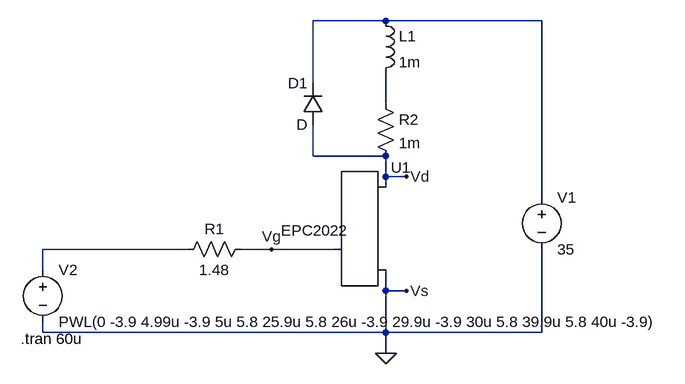
[diagram p0: schematic DPT_EPC2022.asc]
DPT_EPC2022.asc, the LTspice schematic file:
Version 4
SHEET 1 880 680
WIRE -48 -176 -160 -176
WIRE 192 -176 -48 -176
WIRE -160 -80 -160 -176
WIRE -48 -48 -48 -96
WIRE -160 32 -160 -16
WIRE -48 32 -160 32
WIRE -48 64 -48 32
WIRE -16 64 -48 64
WIRE -48 80 -48 64
WIRE 192 96 192 -176
WIRE -352 176 -576 176
WIRE -224 176 -272 176
WIRE -128 176 -224 176
WIRE -576 208 -576 176
WIRE -48 240 -48 208
WIRE -16 240 -48 240
WIRE -576 304 -576 288
WIRE -48 304 -48 240
WIRE -48 304 -576 304
WIRE 192 304 192 176
WIRE 192 304 -48 304
WIRE -48 336 -48 304
FLAG -16 240 Vs
FLAG -16 64 Vd
FLAG -224 176 Vg
FLAG -48 336 0
SYMBOL EPCGaN -128 176 R0
WINDOW 3 -81 -29 Left 2
SYMATTR Value EPC2022
SYMATTR InstName U1
SYMBOL res -64 -64 R0
SYMATTR InstName R2
SYMATTR Value 1m
SYMBOL ind -64 -192 R0
SYMATTR InstName L1
SYMATTR Value 1m
SYMBOL diode -144 -16 R180
WINDOW 0 24 64 Left 2
WINDOW 3 24 0 Left 2
SYMATTR InstName D1
SYMBOL voltage 192 80 R0
WINDOW 123 0 0 Left 0
WINDOW 39 0 0 Left 0
SYMATTR InstName V1
SYMATTR Value 35
SYMBOL voltage -576 192 R0
WINDOW 123 0 0 Left 0
WINDOW 39 0 0 Left 0
SYMATTR InstName V2
SYMATTR Value PWL(0 -3.9 4.99u -3.9 5u 5.8 25.9u 5.8 26u -3.9 29.9u -3.9 30u 5.8 39.9u 5.8 40u -3.9)
SYMBOL res -256 160 R90
WINDOW 0 0 56 VBottom 2
WINDOW 3 32 56 VTop 2
SYMATTR InstName R1
SYMATTR Value 1.48
TEXT -610 314 Left 2 !.tran 60u

The netlist it stands for:
* DPT_EPC2022.asc
XU1 Vg Vd 0 EPC2022
R2 N002 Vd 1m
L1 N001 N002 1m
D1 Vd N001 D
V1 N001 0 35
V2 N003 0 PWL(0 -3.9 4.99u -3.9 5u 5.8 25.9u 5.8 26u -3.9 29.9u -3.9 30u 5.8 39.9u 5.8 40u -3.9)
R1 Vg N003 1.48
.model D D
.lib standard.dio
.tran 60u
.backanno
.end